# EAGLE schematic PWM_Driver (EAGLE 7.6.0)
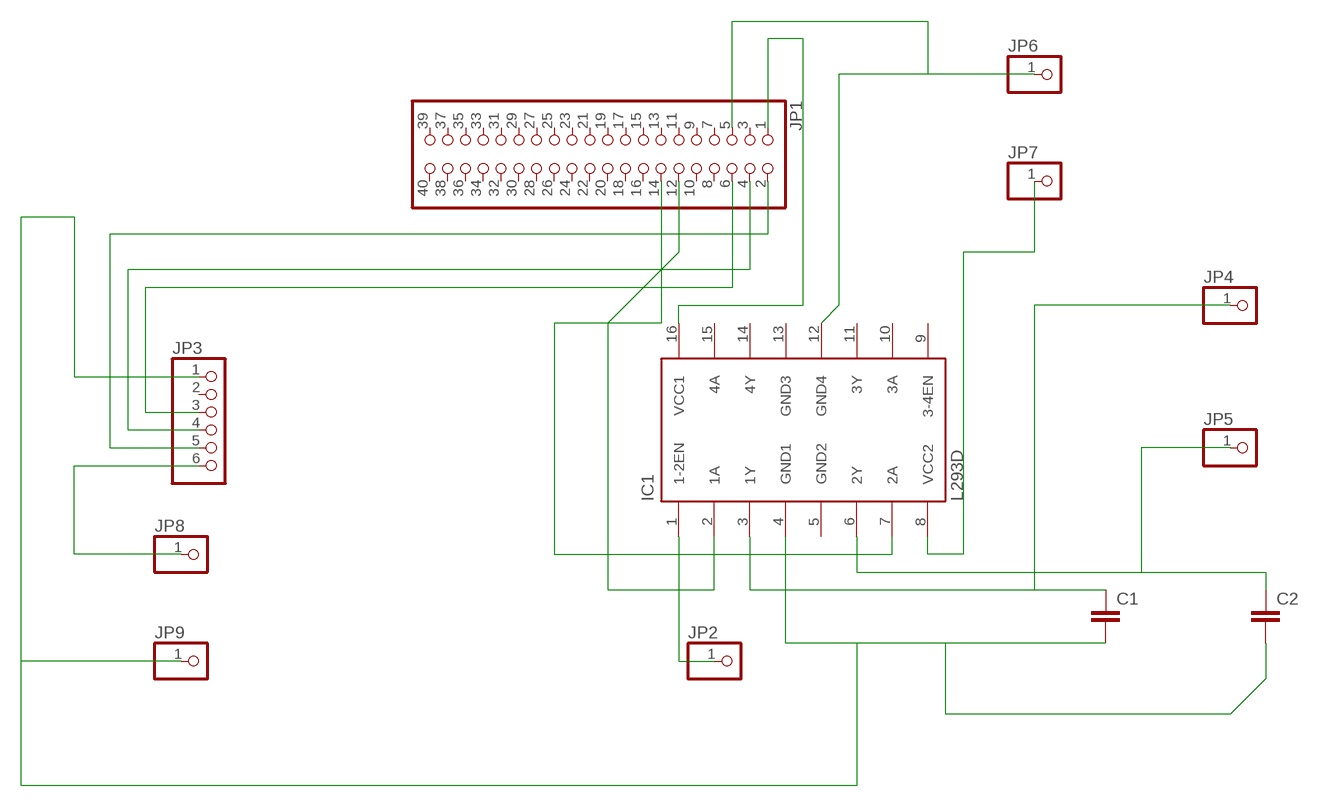
[diagram p0: schematic, sheet 1]

## Parts
C1  C5/5  [C5B5]
C2  C5/5  [C5B5]
IC1  L293D  [DIL16]
JP1  PINHD-2X20  [2X20]
JP2  PINHD-1X1  [1X01]
JP3  PINHD-1X6  [1X06]
JP4  PINHD-1X1  [1X01]
JP5  PINHD-1X1  [1X01]
JP6  PINHD-1X1  [1X01]
JP7  PINHD-1X1  [1X01]
JP8  PINHD-1X1  [1X01]
JP9  PINHD-1X1  [1X01]

## Nets
N$1: IC1.12(GND4) JP1.5 JP6.1
N$2: JP1.2 JP3.5
N$3: JP1.4 JP3.4
N$4: JP1.6 JP3.3
N$5: IC1.1(1-2EN) JP2.1
N$6: C1.1 IC1.3(1Y) JP4.1
N$7: C2.1 IC1.6(2Y) JP5.1
N$8: C1.2 C2.2 IC1.4(GND1) JP3.1 JP9.1
N$9: JP3.6 JP8.1
N$13: IC1.8(VCC2) JP7.1
N$14: IC1.16(VCC1) JP1.1
N$15: IC1.2(1A) JP1.12
N$16: IC1.7(2A) JP1.14
Unconnected: IC1.9(3-4EN) IC1.10(3A) IC1.11(3Y) IC1.14(4Y) IC1.15(4A) JP1.3 JP1.7 JP1.8 JP1.9 JP1.10 JP1.11 JP1.13 JP1.15 JP1.16 JP1.17 JP1.18 JP1.19 JP1.20 JP1.21 JP1.22 JP1.23 JP1.24 JP1.25 JP1.26 JP1.27 JP1.28 JP1.29 JP1.30 JP1.31 JP1.32 JP1.33 JP1.34 JP1.35 JP1.36 JP1.37 JP1.38 JP1.39 JP1.40 JP3.2

## Power pins joined to a net without a drawn wire
GND2: IC1.5(GND2)
GND3: IC1.13(GND3)

## Library data of the parts
C1 C2 = capacitor-wima:C: CAPACITOR naming: grid - package width
IC1 = st-microelectronics:L293D: PUSH-PULL 4 CHANNEL DRIVER; MPN: L293D; OC_FARNELL: 9589619; OC_NEWARK: 56P8249
JP1 = pinhead:PINHD-2X20: PIN HEADER
JP2 JP4-JP9 = pinhead:PINHD-1X1: PIN HEADER
JP3 = pinhead:PINHD-1X6: PIN HEADER